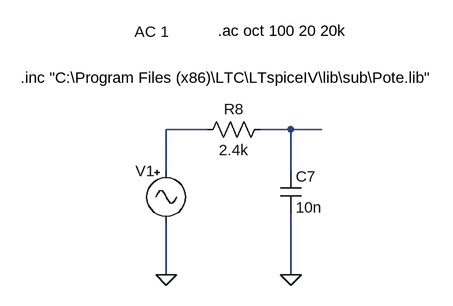
[diagram p0: schematic Светомузыка5.asc]
Светомузыка5.asc, the LTspice schematic file:
Version 4
SHEET 1 1048 1092
WIRE -720 720 -784 720
WIRE -592 720 -640 720
WIRE -544 720 -592 720
WIRE -784 784 -784 720
WIRE -592 784 -592 720
WIRE -784 944 -784 864
WIRE -592 944 -592 848
FLAG -592 944 0
FLAG -784 944 0
SYMBOL res -624 704 R90
WINDOW 0 0 56 VBottom 2
WINDOW 3 32 56 VTop 2
SYMATTR InstName R8
SYMATTR Value 2.4k
SYMBOL cap -608 784 R0
SYMATTR InstName C7
SYMATTR Value 10n
SYMBOL Misc\\signal -784 768 R0
WINDOW 0 -47 16 Left 2
WINDOW 3 -49 -227 Left 2
WINDOW 123 -49 -199 Left 2
WINDOW 39 0 0 Left 2
SYMATTR InstName V1
SYMATTR Value ""
SYMATTR Value2 AC 1
TEXT -704 568 Left 2 !.ac oct 100 20 20k
TEXT -1008 640 Left 2 !.inc "C:\\Program Files (x86)\\LTC\\LTspiceIV\\lib\\sub\\Pote.lib"

The netlist it stands for:
* Светомузыка5.asc
R8 N002 N001 2.4k
C7 N002 0 10n
V1 N001 0 AC 1
.ac oct 100 20 20k
.inc "C:\Program Files (x86)\LTC\LTspiceIV\lib\sub\Pote.lib"
.backanno
.end